# Altium project PCB_Project.PrjPcb
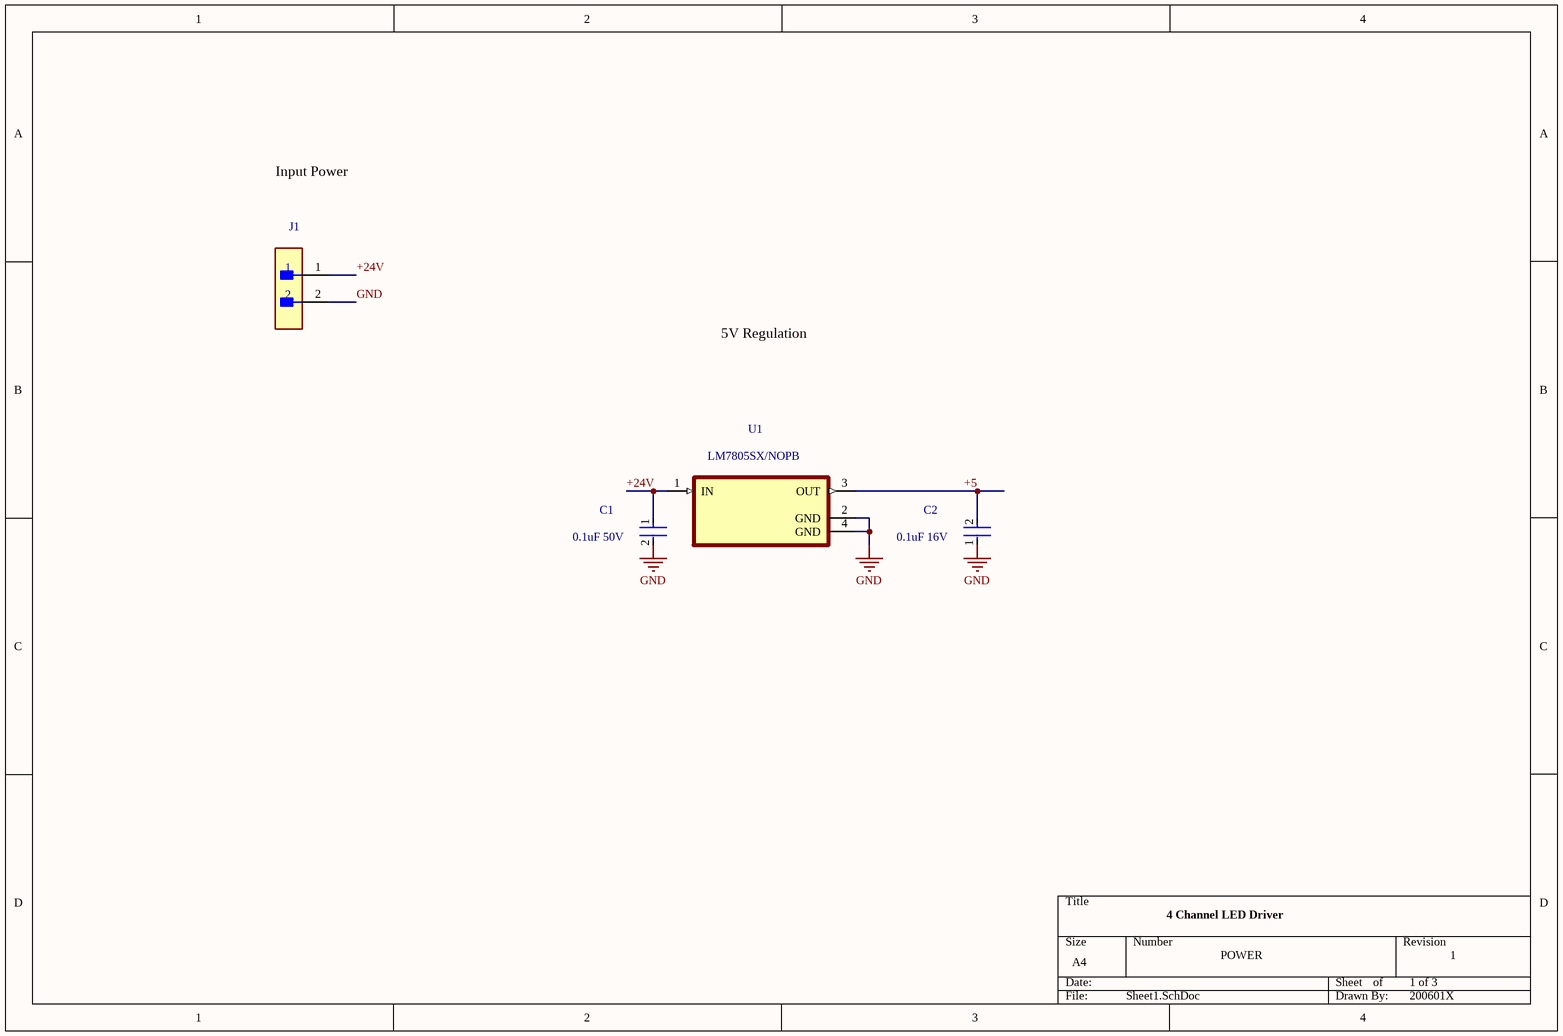
[diagram p0: Sheet1.SchDoc]
3 sheets, 27 parts. Net scope: global (net labels, ports and power ports of the same name join across sheets).
Board file: PCB1.PcbDoc
Sheets:
  Sheet1.SchDoc
  Sheet3.SchDoc
  Sheet2.SchDoc

## Sheet Sheet1.SchDoc
size A4; SheetNumber: 1; SheetTotal: 2

### Parts
C1  0.1uF 50V  [FP-CL21-IPC_C]
C2  0.1uF 16V  [FP-GRM15-MFG]
J1  B2P-VH-FB-B(LF)(SN)  [FP-B2P-VH-FB-B_LF_SN-MFG]  (value not drawn)
U1  LM7805SX/NOPB  [TO254P1524X483-4N]

### Nets
+5: C2.2 U1.3(OUT)
GND: C1.2 C2.1 J1.2 U1.2(GND) U1.4(GND)
+24V: C1.1 J1.1 U1.1(IN)

### Notes on the sheet
- Input Power
- 5V Regulation
- 4 Channel LED Driver
- POWER
- 1 of 3
- 1
- 200601X

### Library data of the parts
C1 = CMP-2000-05017-2: CL21 Series 0805 100nF 50V ±10% Tolerance X7R Multilayer Ceramic Chip Capacitor; Depth: 1.25mm; Height: 0.85mm; Width: 0.049inch; Tolerance: 10%; Case Code (Metric): 2012; Case Code (Imperial): 0805; Material: Ceramic; Thickness: 0.037inch; Min Operating Temperature: -55°C; Contact Plating: Tin; Length: 2mm; Mount: Surface Mount; Voltage Rating (DC): 50V; Lead Free: Lead Free; Dielectric: X7R; Radiation Hardening: No; Capacitance: 100nF; Voltage Rating: 50V; Case/Package: 0805; Packaging: Tape and Reel; Max Operating Temperature: 125°C; Voltage: 50V
C2 = CMP-2100-03641-2: CAP CER 0.1UF 16V X7R 0402; Manufacturer Part Number: GRM155R71C104KA88D; Manufacturer: Murata; Standoff Height: 0mm; Tolerance: 10%; Voltage Rating: 16Vdc; Material: Ceramic; Capacitance: 0.10μF; Value: 0.10μF; RoHS: TRUE; Temperature Characteristic: X7R; Octopart: https://octopart.com/grm155r71c104ka88d-murata-196880; Digikey Description: CAP CER 0.1UF 16V X7R 0402; Device Class L3: Ceramic Capacitors; Height: 0.55mm; ComponentLink2Description: Datasheet; Temperature Range Low: -55°C; Ipc Land Pattern Name: CAPC10050X219; ComponentLink2URL: https://search.murata.co.jp/Ceramy/image/img/A01X/G101/ENG/GRM155R71H471KA01-01A.pdf; Device Class L1: Passive Components; Lead Free: yes; Category: Cap; Package: GRM15; Temperature: -55°C to +125°C; Device Class L2: Capacitors; Temperature Range High: +125°C; Mouser Description: 0402 0.1 uF 16V ±10 % Tolerance X7R SMT Multilayer Ceramic Capacitor
J1 = CMP-17439-000031-1: CONN HEADER VERT 2POS 3.96MM; Connector Type: Male Pin; Pitch: 0.156inch; Number of Positions: 2; Packaging: Bulk; Package Quantity: 250; Termination: Solder; Lead Free: Lead Free; Contact Plating: Tin; Contact Type: Male Pin; Color: Natural; Fastening Type: Ramp; Number of Rows: 1; Mount: Through Hole; Series: VH
U1 = LM7805SX/NOPB: 1.5-A, 30-V, linear voltage regulator 3-DDPAK/TO-263 0 to 125; MF: Texas Instruments; SnapEDA_Link: https://www.snapeda.com/parts/LM7805SX/NOPB/Texas%20Instruments/view-part/545072/?ref=snap; Value: *; MP: LM7805SX/NOPB; Availability: Warning; Texas_Instruments-Purchase-URL: https://snapeda.com/shop?store=Texas+Instruments&id=545072; Package: TO-263-3 Texas Instruments; DigiKey-Purchase-URL: https://snapeda.com/shop?store=DigiKey&id=545072; Price: None; Mouser-Purchase-URL: https://snapeda.com/shop?store=Mouser&id=545072

## Sheet Sheet3.SchDoc
size A; SheetNumber: 2; SheetTotal: 3
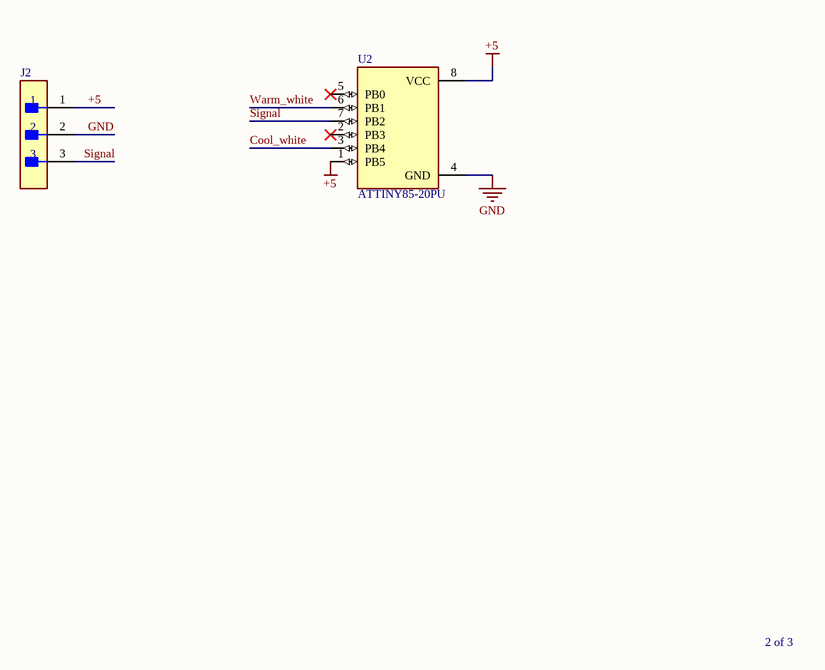
[diagram p1: Sheet3.SchDoc]

### Parts
J2  B3B-XH-A(LF)(SN)  [FP-B3B-XH-A_LF_SN-MFG]  (value not drawn)
U2  ATTINY85-20PU  [DIP762W46P254L927H533Q8B]

### Nets
+5: J2.1 U2.1(PB5) U2.8(VCC)
GND: J2.2 U2.4(GND)
Cool_white: U2.3(PB4)
Signal: J2.3 U2.7(PB2)
Warm_white: U2.6(PB1)

Not connected (* = marked no-connect by the designer): U2 2(PB3)* 5(PB0)*

### Notes on the sheet
- 2 of 3

### Library data of the parts
J2 = CMP-17439-000014-3: CONN HEADER VERT 3POS 2.5MM; Max Voltage Rating (DC): 250V; Number of Positions: 3; Current Rating: 3A; Gender: Male; Wire/Cable Gauge: 22AWG; Contact Resistance: 20mR; Insulation Resistance: 1GR; Insulation Material: Nylon; Contact Plating: Tin; Depth: 5.75mm; Contact Type: Male Pin; Max Operating Temperature: 85°C; Insulation Color: Natural; Voltage Rating (AC): 250V; Color: Natural; Connector Type: Header; Orientation: Straight; Fastening Type: Detent; Housing Color: White; Min Operating Temperature: -25°C; Termination: Solder; Voltage Rating: 250V; Series: XH; Pitch: 2.5mm; Contact Shape: Square; Number of Rows: 1; Lead Free: Lead Free; Packaging: Bulk; Mount: Through Hole; Flammability Rating: UL94 V-0; Max Voltage Rating (AC): 250V; REACH SVHC: No SVHC; Housing Material: Polyamide; Contact Material: Brass; Lead Pitch: 2.5mm; Contact Finish - Mating: TIN; Length: 9.9mm; Max Current Rating: 3A; Number of Contacts: 3
U2 = ATTINY85-20PU: AVR AVRÂ® ATtiny, Functional Safety (FuSa) Microcontroller IC 8-Bit 20MHz 8KB (4K x 16) FLASH 8-PDIP; MF: Microchip; MP: ATTINY85-20PU; Price: None; Purchase-URL: https://pricing.snapeda.com/search/part/ATTINY85-20PU/?ref=eda; Package: DIP-8 Atmel; Check_prices: https://www.snapeda.com/parts/ATTINY85-20PU/Microchip/view-part/42827/?ref=eda; Value: *; Availability: Good; SnapEDA_Link: https://www.snapeda.com/parts/ATTINY85-20PU/Microchip/view-part/42827/?ref=snap

## Sheet Sheet2.SchDoc
size A4; SheetNumber: 2; SheetTotal: 2
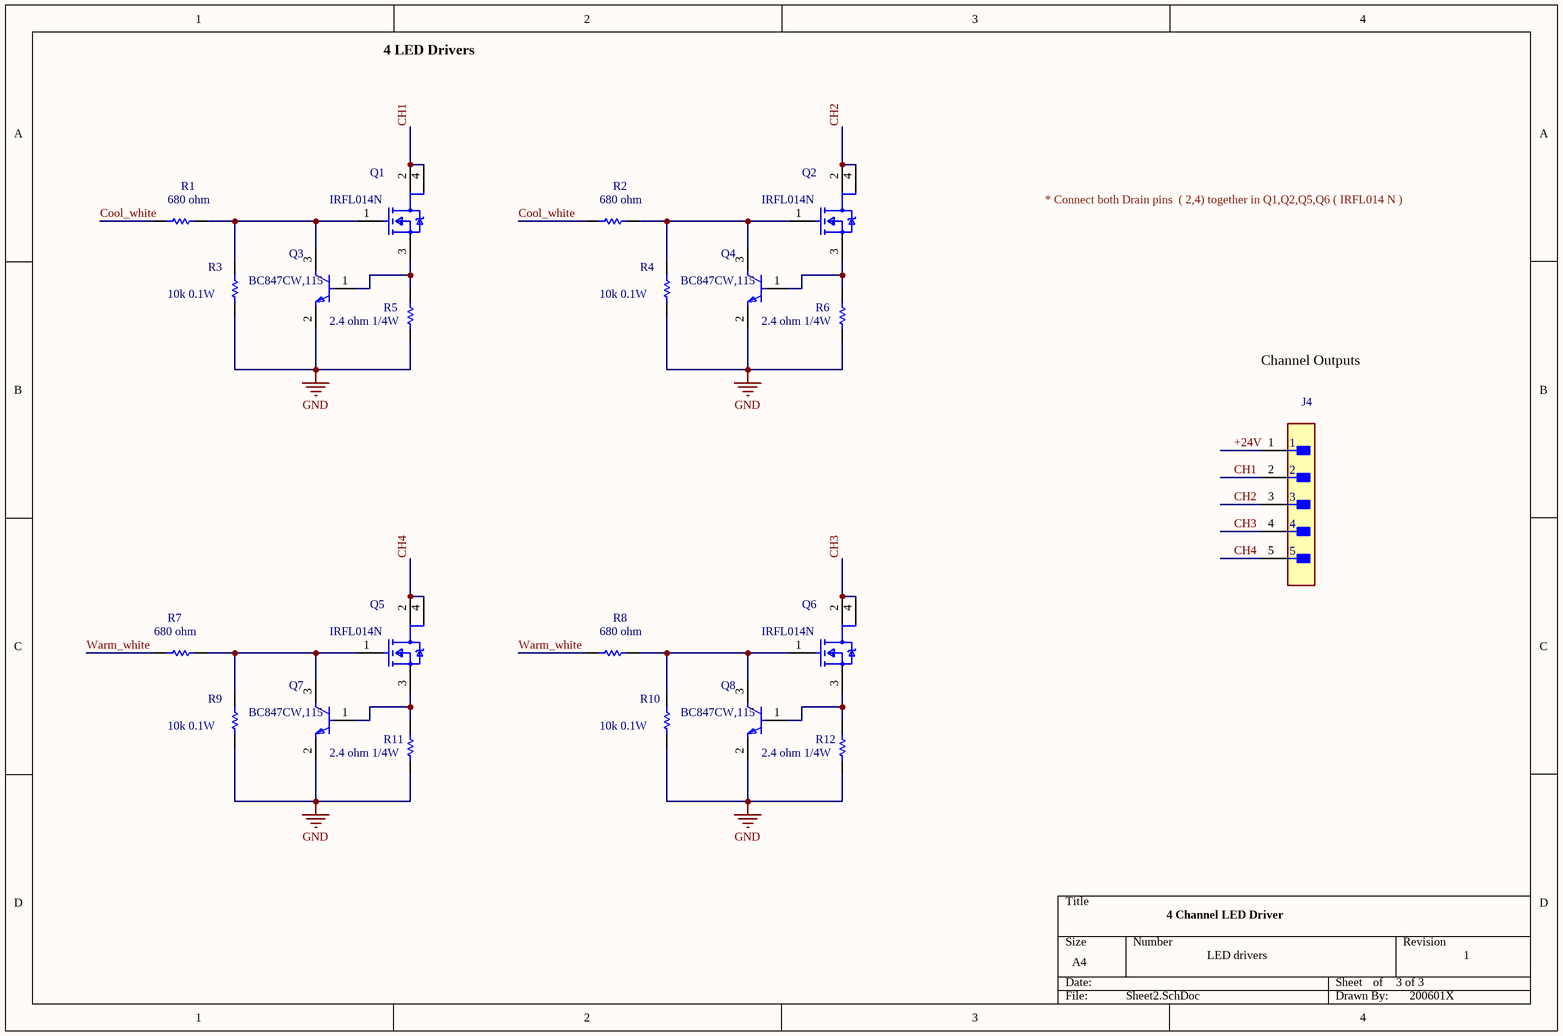
[diagram p2: Sheet2.SchDoc]

### Parts
J4  B5B-XH-AM(LF)(SN)  [FP-B5B-XH-AM_LF_SN-MFG]  (value not drawn)
Q1  IRFL014N  [FP-P-SOT223-3-MFG]
Q2  IRFL014N  [FP-P-SOT223-3-MFG]
Q3  BC847CW,115  [FP-SOT323-IPC_A]
Q4  BC847CW,115  [FP-SOT323-IPC_A]
Q5  IRFL014N  [FP-P-SOT223-3-MFG]
Q6  IRFL014N  [FP-P-SOT223-3-MFG]
Q7  BC847CW,115  [FP-SOT323-IPC_A]
Q8  BC847CW,115  [FP-SOT323-IPC_A]
R1  680 ohm  [RESC2013X50X30NL20T20]
R2  680 ohm  [RESC2013X50X30NL20T20]
R3  10k 0.1W  [RESC1609X50X30NL8T20]
R4  10k 0.1W  [RESC1609X50X30NL8T20]
R5  2.4 ohm 1/4W  [RESC3116X65X40LL10T20]
R6  2.4 ohm 1/4W  [RESC3116X65X40LL10T20]
R7  680 ohm  [RESC2013X50X30NL20T20]
R8  680 ohm  [RESC2013X50X30NL20T20]
R9  10k 0.1W  [RESC1609X50X30NL8T20]
R10  10k 0.1W  [RESC1609X50X30NL8T20]
R11  2.4 ohm 1/4W  [RESC3116X65X40LL10T20]
R12  2.4 ohm 1/4W  [RESC3116X65X40LL10T20]

### Nets
GND: Q3.2(E) Q4.2(E) Q7.2(E) Q8.2(E) R3.1 R4.1 R5.1 R6.1 R9.1 R10.1 R11.1 R12.1
+24V: J4.1
CH1: J4.2 Q1.2(DRAIN) Q1.4(DRAIN)
CH2: J4.3 Q2.2(DRAIN) Q2.4(DRAIN)
CH3: J4.4 Q6.2(DRAIN) Q6.4(DRAIN)
CH4: J4.5 Q5.2(DRAIN) Q5.4(DRAIN)
Cool_white: R1.1 R2.1
Warm_white: R7.1 R8.1
NetQ1_1: Q1.1(GATE) Q3.3(C) R1.2 R3.2
NetQ1_3: Q1.3(SOURCE) Q3.1(B) R5.2
NetQ2_1: Q2.1(GATE) Q4.3(C) R2.2 R4.2
NetQ2_3: Q2.3(SOURCE) Q4.1(B) R6.2
NetQ5_1: Q5.1(GATE) Q7.3(C) R7.2 R9.2
NetQ5_3: Q5.3(SOURCE) Q7.1(B) R11.2
NetQ6_1: Q6.1(GATE) Q8.3(C) R8.2 R10.2
NetQ6_3: Q6.3(SOURCE) Q8.1(B) R12.2

### Notes on the sheet
- 4 LED Drivers
- * Connect both Drain pins  ( 2,4) together in Q1,Q2,Q5,Q6 ( IRFL014 N )
- Channel Outputs
- 4 Channel LED Driver
- LED drivers
- 3 of 3
- 1
- 200601X

### Library data of the parts
J4 = CMP-17439-000304-1: CONN HEADER VERT 5POS 2.5MM; Mated Stacking Heights: 9.8mm; Voltage Rating: 250V; Max Current Rating: 3A; Number of Positions: 5; Contact Resistance: 20mR; Depth: 5.75mm; Connector Type: Header; Color: Green; Insulation Material: Nylon; Contact Plating: Copper; Length: 14.9mm; Fastening Type: Detent; Contact Material: Brass; Number of Rows: 1; Contact Type: Male Pin; Housing Material: Polyamide; Housing Color: White; Lead Free: Lead Free; Max Voltage Rating (AC): 250V; Mount: Through Hole; Contact Shape: Square; Min Operating Temperature: -25°C; Packaging: Bulk; Orientation: Straight; Insulation Color: Natural; Series: XH; Flammability Rating: UL94 V-0; Contact Finish - Mating: TIN; Max Operating Temperature: 85°C; Termination: Solder; Pitch: 2.5mm
Q1 Q2 Q5 Q6 = CMP-32901-000109-1: MOSFET N-CH 55V 1.9A SOT223; Manufacturer: Infineon; Obsolete Part: false; Manufacturer Part Number: IRFL014NTRPBF; Number Of N Channels: 1; Threshold Vgs Min: 2V; Reverse Recovery Charge: 64nC; Reverse Recovery Time: 41ns; Rthja Max: 120°C/W; Gate To Source Voltage: 20V; Turn Off Delay Time: 12ns; Max Forward Diode Voltage: 1V; Gate Charge At Vgs: 7nC @ 10V; Input Capacitace At Vds: 190pF @ 25V; Max Junction Temp: +150°C; Standoff Height: 0.061mm; Threshold Vgs Max: 4V; Power Dissipation: 1W; Drain To Source Resistance: 0.16Ω; Pulse Drain Current: 15A; Turn On Delay Time: 6.6ns; ComponentLink2Description: Datasheet; Drain To Source Voltage: 55V; Package: P-SOT223-3; Continuous Drain Current: 1.9A; Drain To Source Breakdown Voltage: 55V; Octopart: https://octopart.com/irfl014ntrpbf-infineon-65874001; Category: Trans; Footprint Url: https://www.infineon.com/dgdl/po-sot223.pdf?fileId=5546d462580663ef0158068bea690191; Device Class L2: Transistors; Automotive: No; Digikey Description: MOSFET N-CH 55V 1.9A SOT223; Number Of Channels: 1; Temperature: -55°C to +150°C; Ipc Land Pattern Name: SOT230P700X168-4; Temperature Range High: +150°C; ComponentLink2URL: https://www.infineon.com/dgdl/irfl014npbf.pdf?fileId=5546d462533600a401535627c5321fac; Temperature Range Low: -55°C; Device Class L3: MOSFETs; Device Class L1: Discrete Semiconductors; RoHS: TRUE; Height: 1.8mm; Depletion Mode: False; Lead Free: Yes
Q3 Q4 Q7 Q8 = CMP-14406-000045-1: TRANS NPN 45V 100MA SOT323; RoHS Compliant: Yes
R1 R2 R7 R8 = CMP-2001-04066-1: Manufacturer: Vishay Dale; Part Number: CRCW0805680RFKEA
R3 R4 R9 R10 = CMP-1666-00005-4: Chip Resistor, 10 KOhm, +/- 1%, 100 mW, -55 to 155 degC, 0603 (1608 Metric), RoHS, Tape and Reel; Manufacturer: Vishay Semiconductor; Voltage Rating: 75 V; Max Operating Temperature: 155 degC; PackageDescription: 2-Pin Surface Mount Device, Body 1.575 x 0.85 mm; ComponentLink1Description: Manufacturer URL; RoHSCompliant: true; PackageReference: 0603; REACH SVHC: Unknown; Length: 1.55 mm; DatasheetVersion: 06/2012; Packaging: Tape and Reel; Min Operating Temperature: -55 degC; Mounting Technology: Surface Mount; ComponentLink2URL: https://datasheet.ciiva.com/11809/0900766b80d98afc-11809037.pdf; Height: 0.45 mm; ComponentLink2Description: Datasheet; Package Quantity: 5000; ComponentLink1URL: http://www.vishay.com/
R5 R6 R11 R12 = CMP-2003-03693-1: Manufacturer: Yageo; Part Number: RC1206FR-072R4L

## Nets that join several sheets
+5: Sheet1 (C2.2 U1.3), Sheet3 (J2.1 U2.1 U2.8)
GND: Sheet1 (5 pins), Sheet3 (J2.2 U2.4), Sheet2 (12 pins)
+24V: Sheet1 (C1.1 J1.1 U1.1), Sheet2 (J4.1)
Cool_white: Sheet3 (U2.3), Sheet2 (R1.1 R2.1)
Warm_white: Sheet3 (U2.6), Sheet2 (R7.1 R8.1)